# Altium schematic sheet ControlVoltage.SchDoc
size A3; SheetNumber: 3; SheetTotal: 5
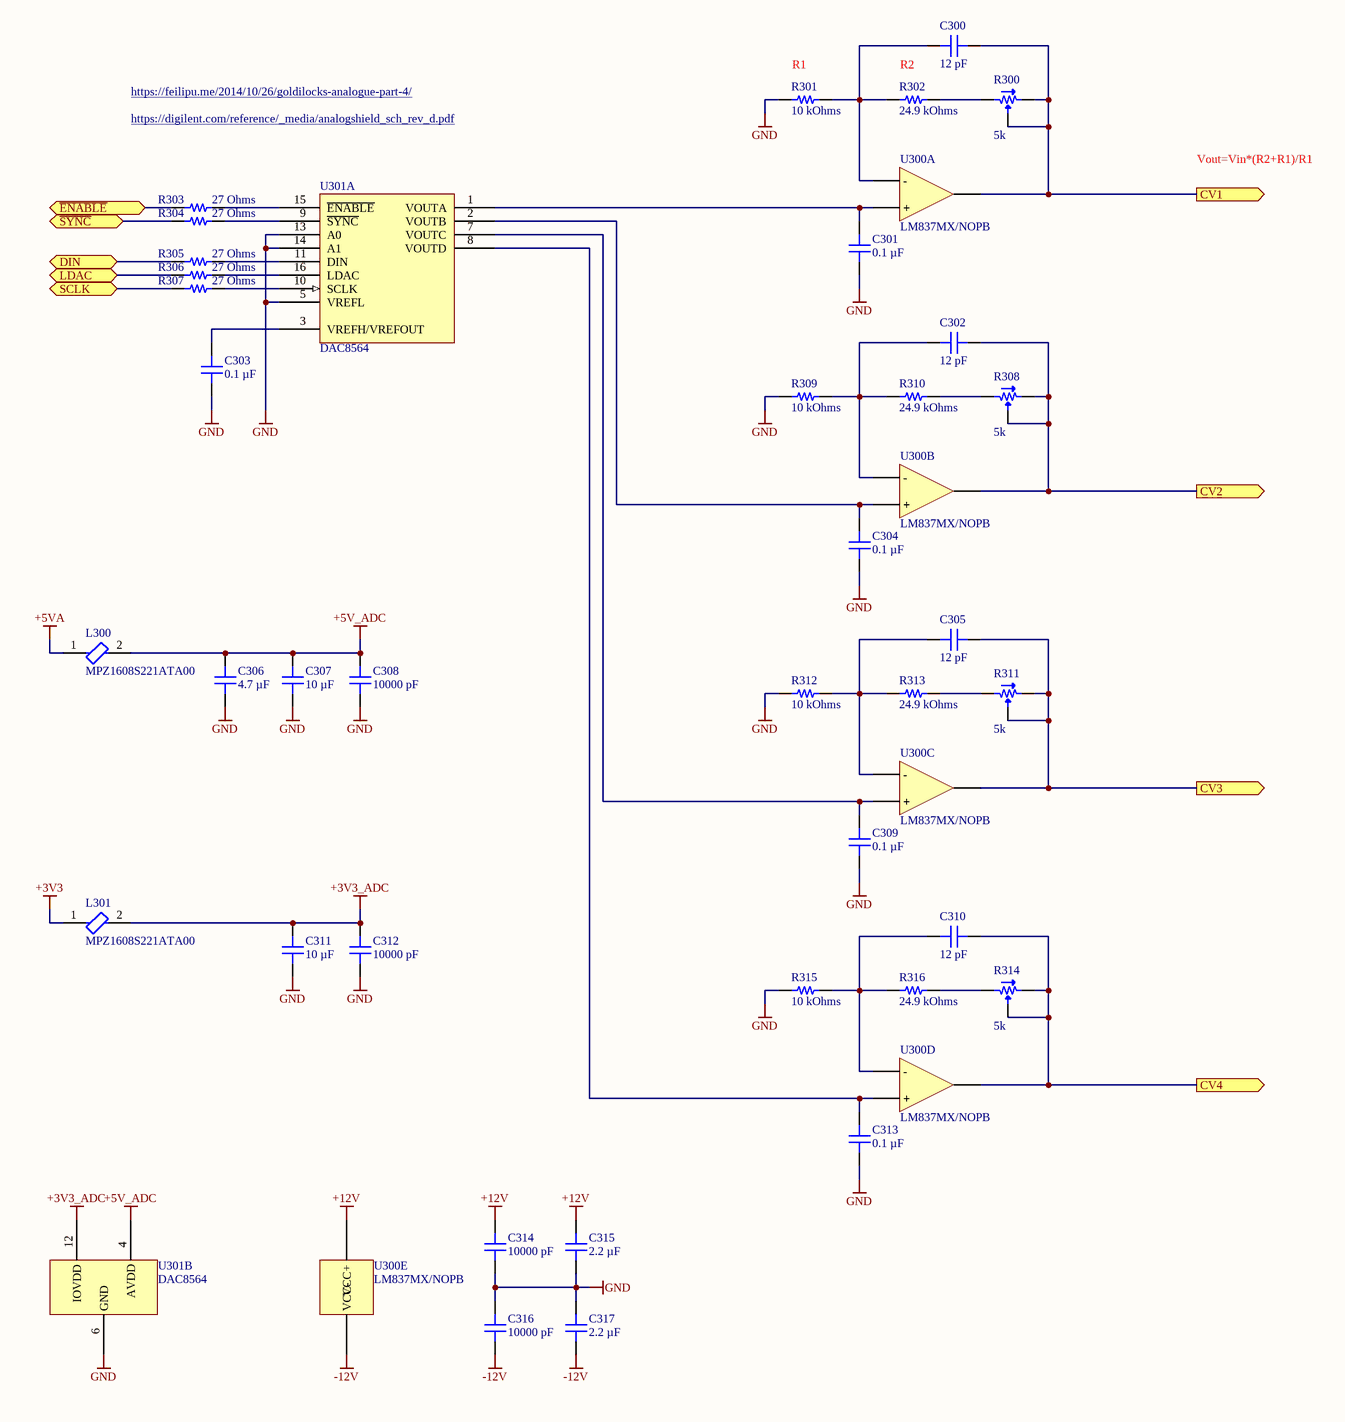
[diagram p0: ControlVoltage.SchDoc]

## Parts
C300  12 pF  [CAP 0603_1608]
C301  0.1 µF  [CAP 0603_1608]
C302  12 pF  [CAP 0603_1608]
C303  0.1 µF  [CAP 0603_1608]
C304  0.1 µF  [CAP 0603_1608]
C305  12 pF  [CAP 0603_1608]
C306  4.7 µF  [CAP 0603_1608]
C307  10 µF  [CAP 0603_1608]
C308  10000 pF  [CAP 0603_1608]
C309  0.1 µF  [CAP 0603_1608]
C310  12 pF  [CAP 0603_1608]
C311  10 µF  [CAP 0603_1608]
C312  10000 pF  [CAP 0603_1608]
C313  0.1 µF  [CAP 0603_1608]
C314  10000 pF  [CAP 0603_1608]
C315  2.2 µF  [CAP 0603_1608]
C316  10000 pF  [CAP 0603_1608]
C317  2.2 µF  [CAP 0603_1608]
L300  MPZ1608S221ATA00  [FP-MPZ1608-0_8-MFG]
L301  MPZ1608S221ATA00  [FP-MPZ1608-0_8-MFG]
R300  5k  [BOURNS_TRIM_3296]
R301  10 kOhms  [RES 0603_1608]
R302  24.9 kOhms  [RES 0603_1608]
R303  27 Ohms  [RES 0603_1608]
R304  27 Ohms  [RES 0603_1608]
R305  27 Ohms  [RES 0603_1608]
R306  27 Ohms  [RES 0603_1608]
R307  27 Ohms  [RES 0603_1608]
R308  5k  [BOURNS_TRIM_3296]
R309  10 kOhms  [RES 0603_1608]
R310  24.9 kOhms  [RES 0603_1608]
R311  5k  [BOURNS_TRIM_3296]
R312  10 kOhms  [RES 0603_1608]
R313  24.9 kOhms  [RES 0603_1608]
R314  5k  [BOURNS_TRIM_3296]
R315  10 kOhms  [RES 0603_1608]
R316  24.9 kOhms  [RES 0603_1608]
U300  LM837MX/NOPB  [FP-D0014A-IPC_B]  (parts A,B,C,D,E of 5)
U301  DAC8564  [SOP65P640X120-16N]  (parts A,B of 2)

## Ports
CV1 (out), CV2 (out), CV3 (out), CV4 (out), DIN (bidir), LDAC (bidir), SCLK (bidir), ~{ENABLE} (bidir), ~{SYNC} (bidir)

## Nets
+3V3: L301.1
+3V3_ADC: C311.2 C312.2 L301.2 U301.12(IOVDD)
+5V_ADC: C306.2 C307.2 C308.2 L300.2 U301.4(AVDD)
+5VA: L300.1
+12V: C314.2 C315.2 U300.4(VCC+)
-12V: C316.1 C317.1 U300.11(VCC-)
GND: C301.1 C303.1 C304.1 C306.1 C307.1 C308.1 C309.1 C311.1 C312.1 C313.1 C314.1 C315.1 C316.2 C317.2 R301.1 R309.1 R312.1 R315.1 U301.5(VREFL) U301.6(GND) U301.13(A0) U301.14(A1)
CV1: C300.2 R300.2 R300.3 U300.1(Output) ; port CV1
CV2: C302.2 R308.2 R308.3 U300.7(Output) ; port CV2
CV3: C305.2 R311.2 R311.3 U300.8(Output) ; port CV3
CV4: C310.2 R314.2 R314.3 U300.14(Output) ; port CV4
DIN: R305.1 ; port DIN
~{ENABLE}: R303.1 ; port ~{ENABLE}
LDAC: R306.1 ; port LDAC
~{SYNC}: R304.1 ; port ~{SYNC}
SCLK: R307.1 ; port SCLK
NetC300_1: C300.1 R301.2 R302.1 U300.2(-)
NetC301_2: C301.2 U300.3(+) U301.1(VOUTA)
NetC302_1: C302.1 R309.2 R310.1 U300.6(-)
NetC303_2: C303.2 U301.3(VREFH/VREFOUT)
NetC304_2: C304.2 U300.5(+) U301.2(VOUTB)
NetC305_1: C305.1 R312.2 R313.1 U300.9(-)
NetC309_2: C309.2 U300.10(+) U301.7(VOUTC)
NetC310_1: C310.1 R315.2 R316.1 U300.13(-)
NetC313_2: C313.2 U300.12(+) U301.8(VOUTD)
NetR300_1: R300.1 R302.2
NetR303_2: R303.2 U301.15(~{ENABLE})
NetR304_2: R304.2 U301.9(~{SYNC})
NetR305_2: R305.2 U301.11(DIN)
NetR306_2: R306.2 U301.16(LDAC)
NetR307_2: R307.2 U301.10(SCLK)
NetR308_1: R308.1 R310.2
NetR311_1: R311.1 R313.2
NetR314_1: R314.1 R316.2

## Notes on the sheet
- https://feilipu.me/2014/10/26/goldilocks-analogue-part-4/
- https://digilent.com/reference/_media/analogshield_sch_rev_d.pdf
- (near R301) R1
- R2
- Vout=Vin*(R2+R1)/R1

## Library data of the parts
C300 C302 C305 C310 = CC0603KRNPO9BN120: CAP CER 12PF 50V C0G/NPO 0603; manufacturer: Yageo; Temperature Coefficient: C0G, NP0; Tolerance: ±10%; Part Number: CC0603KRNPO9BN120; Value: 12 pF; Applications: General Purpose; Capacitance: 12 pF; componentlink1description: Datasheet; componentlink1url: https://www.yageo.com/upload/media/product/productsearch/datasheet/mlcc/UPY-GP_NP0_16V-to-50V_17.pdf; componentlink2description: DigiKey Link; componentlink2url: https://www.digikey.com/en/products/detail/yageo/CC0603KRNPO9BN120/5883704; Device Package: 0603 (1608 Metric); lastupdated: 09/02/2024 20:10:23; Lifecycle Status: Active; Minimum Order: 1; Mounting Type: Surface Mount, MLCC; Operating Temperature: -55°C ~ 125°C; Package / Case: 0603 (1608 Metric); packaging: TapeAndReel; partid: 7814; Part Status: Active; price: 0.01; series: CC; Size / Dimension: 0.063" L x 0.031" W (1.60mm x 0.80mm); Supplier 1: DigiKey; Supplier Part Number 1: 311-4027-1-ND; Thickness (Max): 0.035" (0.90mm); Voltage - Rated: 50V
C301 C304 C309 C313 = CS0603KRX7R7BB104: CAP CER 0.1UF 16V X7R 0603; manufacturer: Yageo; Tolerance: ±10%; Part Number: CS0603KRX7R7BB104; Value: 0.1 µF; Applications: Boardflex Sensitive; Capacitance: 0.1 µF; componentlink1description: Datasheet; componentlink1url: http://www.yageo.com/NewPortal/yageodocoutput?fileName=/pdf/MLCC/UPY-ST_NPOX7R_16V-to-3KV_5.pdf; componentlink2description: DigiKey Link; componentlink2url: https://www.digikey.com/en/products/detail/yageo/CS0603KRX7R7BB104/6097897; Device Package: 0603 (1608 Metric); Features: Soft Termination; lastupdated: 09/02/2024 20:10:30; Lifecycle Status: Active; Minimum Order: 1; Mounting Type: Surface Mount, MLCC; Operating Temperature: -55°C ~ 125°C; Package / Case: 0603 (1608 Metric); packaging: TapeAndReel; partid: 2286; Part Status: Active; price: 0.01; series: CS; Size / Dimension: 0.063" L x 0.031" W (1.60mm x 0.80mm); Supplier 1: DigiKey; Supplier Part Number 1: 311-3560-1-ND; Temperature Coefficient: X7R; Thickness (Max): 0.037" (0.95mm); Voltage - Rated: 16V
C303 = CC0603MRY5V8BB104: CAP CER 0.1UF 25V Y5V 0603; manufacturer: Yageo; Temperature Coefficient: Y5V (F); Tolerance: ±20%; Part Number: CC0603MRY5V8BB104; Value: 0.1 µF; Applications: General Purpose; Capacitance: 0.1 µF; componentlink1description: Datasheet; componentlink1url: http://www.yageo.com/documents/recent/UPY-GPHC_Y5V_6.3V-to-50V_8.pdf; componentlink2description: DigiKey Link; componentlink2url: https://www.digikey.com/en/products/detail/yageo/CC0603MRY5V8BB104/2103101; Device Package: 0603 (1608 Metric); lastupdated: 09/02/2024 20:10:27; Lifecycle Status: Active; Minimum Order: 1; Mounting Type: Surface Mount, MLCC; Operating Temperature: -30°C ~ 85°C; Package / Case: 0603 (1608 Metric); packaging: TapeAndReel; partid: 5132; Part Status: Active; price: 0.01; series: CC; Size / Dimension: 0.063" L x 0.031" W (1.60mm x 0.80mm); Supplier 1: DigiKey; Supplier Part Number 1: 311-1363-1-ND; Thickness (Max): 0.035" (0.90mm); Voltage - Rated: 25V
C306 = CC0603MRX5R6BB475: CAP CER 4.7UF 10V X5R 0603; manufacturer: Yageo; Tolerance: ±20%; Part Number: CC0603MRX5R6BB475; Value: 4.7 µF; Applications: General Purpose; Capacitance: 4.7 µF; componentlink1description: Datasheet; componentlink1url: https://www.yageo.com/upload/media/product/productsearch/datasheet/mlcc/UPY-GPHC_X5R_4V-to-50V_25.pdf; componentlink2description: DigiKey Link; componentlink2url: https://www.digikey.com/en/products/detail/yageo/CC0603MRX5R6BB475/5195227; Device Package: 0603 (1608 Metric); lastupdated: 09/02/2024 20:10:21; Lifecycle Status: Active; Minimum Order: 1; Mounting Type: Surface Mount, MLCC; Operating Temperature: -55°C ~ 85°C; Package / Case: 0603 (1608 Metric); packaging: TapeAndReel; partid: 9357; Part Status: Active; price: 0.02; series: CC; Size / Dimension: 0.063" L x 0.031" W (1.60mm x 0.80mm); Supplier 1: DigiKey; Supplier Part Number 1: 311-1820-1-ND; Temperature Coefficient: X5R; Thickness (Max): 0.035" (0.90mm); Voltage - Rated: 10V
C307 C311 = CC0603MRX5R4BB106: CAP CER 10UF 4V X5R 0603; manufacturer: Yageo; Tolerance: ±20%; Part Number: CC0603MRX5R4BB106; Value: 10 µF; Applications: General Purpose; Capacitance: 10 µF; componentlink1description: Datasheet; componentlink1url: https://www.yageo.com/upload/media/product/productsearch/datasheet/mlcc/UPY-GPHC_X5R_4V-to-50V_25.pdf; componentlink2description: DigiKey Link; componentlink2url: https://www.digikey.com/en/products/detail/yageo/CC0603MRX5R4BB106/5195219; Device Package: 0603 (1608 Metric); lastupdated: 09/02/2024 20:10:08; Lifecycle Status: Active; Minimum Order: 1; Mounting Type: Surface Mount, MLCC; Operating Temperature: -55°C ~ 85°C; Package / Case: 0603 (1608 Metric); packaging: TapeAndReel; partid: 16863; Part Status: Active; price: 0.02; series: CC; Size / Dimension: 0.063" L x 0.031" W (1.60mm x 0.80mm); Supplier 1: DigiKey; Supplier Part Number 1: 311-1812-1-ND; Temperature Coefficient: X5R; Thickness (Max): 0.035" (0.90mm); Voltage - Rated: 4V
C308 C312 C314 C316 = CC0603JRX7R9BB103: CAP CER 10000PF 50V X7R 0603; manufacturer: Yageo; Tolerance: ±5%; Part Number: CC0603JRX7R9BB103; Value: 10000 pF; Applications: General Purpose; Capacitance: 10000 pF; componentlink1description: Datasheet; componentlink1url: https://www.yageo.com/upload/media/product/productsearch/datasheet/mlcc/UPY-GPHC_X7R_6.3V-to-50V_18.pdf; componentlink2description: DigiKey Link; componentlink2url: https://www.digikey.com/en/products/detail/yageo/CC0603JRX7R9BB103/5195187; Device Package: 0603 (1608 Metric); lastupdated: 09/02/2024 20:10:26; Lifecycle Status: Active; Minimum Order: 1; Mounting Type: Surface Mount, MLCC; Operating Temperature: -55°C ~ 125°C; Package / Case: 0603 (1608 Metric); packaging: TapeAndReel; partid: 5230; Part Status: Active; price: 0.01; series: CC; Size / Dimension: 0.063" L x 0.031" W (1.60mm x 0.80mm); Supplier 1: DigiKey; Supplier Part Number 1: 311-1778-1-ND; Temperature Coefficient: X7R; Thickness (Max): 0.035" (0.90mm); Voltage - Rated: 50V
C315 C317 = CC0603ZRY5V7BB225: CAP CER 2.2UF 16V Y5V 0603; manufacturer: Yageo; Temperature Coefficient: Y5V (F); Tolerance: -20%, +80%; Part Number: CC0603ZRY5V7BB225; Value: 2.2 µF; Applications: General Purpose; Capacitance: 2.2 µF; componentlink1description: Datasheet; componentlink1url: http://www.yageo.com/documents/recent/UPY-GPHC_Y5V_6.3V-to-50V_8.pdf; componentlink2description: DigiKey Link; componentlink2url: https://www.digikey.com/en/products/detail/yageo/CC0603ZRY5V7BB225/5883851; Device Package: 0603 (1608 Metric); lastupdated: 09/02/2024 20:10:30; Lifecycle Status: Active; Minimum Order: 1; Mounting Type: Surface Mount, MLCC; Operating Temperature: -30°C ~ 85°C; Package / Case: 0603 (1608 Metric); packaging: TapeAndReel; partid: 2203; Part Status: Active; price: 0.01; series: CC; Size / Dimension: 0.063" L x 0.031" W (1.60mm x 0.80mm); Supplier 1: DigiKey; Supplier Part Number 1: 311-3416-1-ND; Thickness (Max): 0.035" (0.90mm); Voltage - Rated: 16V
L300 L301 = CMP-08257-000028-1: Power line Ferrite Bead 220Ω @ 100MHz 2.2A DCR 0.05Ω SMD 0603; DC Resistance (DCR): 50mR; Tolerance: 25%; Impedance: 220R; Series: MPZ; Width: 0.031inch; REACH SVHC: No SVHC; Case Code (Imperial): 0603; Current Rating: 2.2A; Case/Package: 0603; Packaging: Cut Tape; Height: 0.037inch; Number of Pins: 2; Max DC Current: 2.2A; Lead Free: Lead Free; RoHS Compliant: Yes; Mount: Surface Mount; Case Code (Metric): 1608; Length: 0.063inch; Package Quantity: 1; Core Material: Ferrite
R300 R308 R311 R314 = BOURNS_TRIM_POT_3296: Bourns Trimmer Resistor - Through Hole - Series 3296
R301 R309 R312 R315 = CRCW060310K0FKTA: RES SMD 10K OHM 1% 1/10W 0603; Manufacturer: Vishay Dale; Power (Watts): 0.1W, 1/10W; Temperature Coefficient: ±100ppm/°C; Part Number: CRCW060310K0FKTA; Value: 10 kOhms; ComponentLink1Description: Datasheet; ComponentLink1URL: http://www.vishay.com/docs/20008/dcrcw.pdf; ComponentLink2Description: DigiKey Link; ComponentLink2URL: https://www.digikey.com/en/products/detail/vishay-dale/CRCW060310K0FKTA/1221625; Composition: Thick Film; Device Package: 0603 (1608 Metric); Features: Automotive AEC-Q200; Height - Seated (Max): 0.020" (0.50mm); LastUpdated: 12/07/2023 19:33:59; Lifecycle Status: Active; Minimum Order: 1; Number of Terminations: 2; Operating Temperature: -55°C ~ 155°C; Package / Case: 0603 (1608 Metric); Packaging: TapeAndReel; PartId: 9687; Part Status: Active; Price: 0.01; Ratings: AEC-Q200; Resistance: 10 kOhms; Series: CRCW; Size / Dimension: 0.063" L x 0.033" W (1.60mm x 0.85mm); Supplier 1: DigiKey; Supplier Part Number 1: 541-2980-1-ND; Supplier Device Package: 0603; Tolerance: ±1%
R302 R310 R313 R316 = CRCW060324K9FKEAC: RES 24.9K OHM 1% 1/10W 0603; Manufacturer: Vishay Dale; Power (Watts): 0.1W, 1/10W; Temperature Coefficient: ±100ppm/°C; Part Number: CRCW060324K9FKEAC; Value: 24.9 kOhms; ComponentLink1Description: Datasheet; ComponentLink1URL: http://www.vishay.com/docs/28773/crcwce3.pdf; ComponentLink2Description: DigiKey Link; ComponentLink2URL: https://www.digikey.com/en/products/detail/vishay-dale/CRCW060324K9FKEAC/7928450; Composition: Thick Film; Device Package: 0603 (1608 Metric); Height - Seated (Max): 0.022" (0.55mm); LastUpdated: 09/02/2024 20:43:05; Lifecycle Status: Active; Minimum Order: 1; Number of Terminations: 2; Operating Temperature: -55°C ~ 155°C; Package / Case: 0603 (1608 Metric); Packaging: TapeAndReel; PartId: 12748; Part Status: Active; Price: 0.01; Resistance: 24.9 kOhms; Series: CRCW-C; Supplier 1: DigiKey; Supplier Part Number 1: 541-4028-1-ND; Supplier Device Package: 0603; Tolerance: ±1%
R303-R307 = CRCW060327R0FKEA: RES SMD 27 OHM 1% 1/10W 0603; Manufacturer: Vishay Dale; Power (Watts): 0.1W, 1/10W; Temperature Coefficient: ±100ppm/°C; Part Number: CRCW060327R0FKEA; Value: 27 Ohms; ComponentLink1Description: Datasheet; ComponentLink1URL: http://www.vishay.com/docs/20035/dcrcwe3.pdf; ComponentLink2Description: DigiKey Link; ComponentLink2URL: https://www.digikey.com/en/products/detail/vishay-dale/CRCW060327R0FKEA/1174487; Composition: Thick Film; Device Package: 0603 (1608 Metric); Features: Automotive AEC-Q200; Height - Seated (Max): 0.020" (0.50mm); LastUpdated: 09/02/2024 20:43:24; Lifecycle Status: Active; Minimum Order: 1; Number of Terminations: 2; Operating Temperature: -55°C ~ 155°C; Package / Case: 0603 (1608 Metric); Packaging: TapeAndReel; PartId: 8035; Part Status: Active; Price: 0.01; Ratings: AEC-Q200; Resistance: 27 Ohms; Series: CRCW; Size / Dimension: 0.061" L x 0.033" W (1.55mm x 0.85mm); Supplier 1: DigiKey; Supplier Part Number 1: 541-27.0HCT-ND; Supplier Device Package: 0603; Tolerance: ±1%
U300 = LM837MX/NOPB: IC OPAMP GP 4 CIRCUIT 14SOIC
U301 = DAC8564: Digital to Analog Converters - DAC 16B Quad Ch Ultra-Lo Glitch Vltg Output